# Altium schematic sheet PAGE15.SchDoc
size 386 x 284 mm
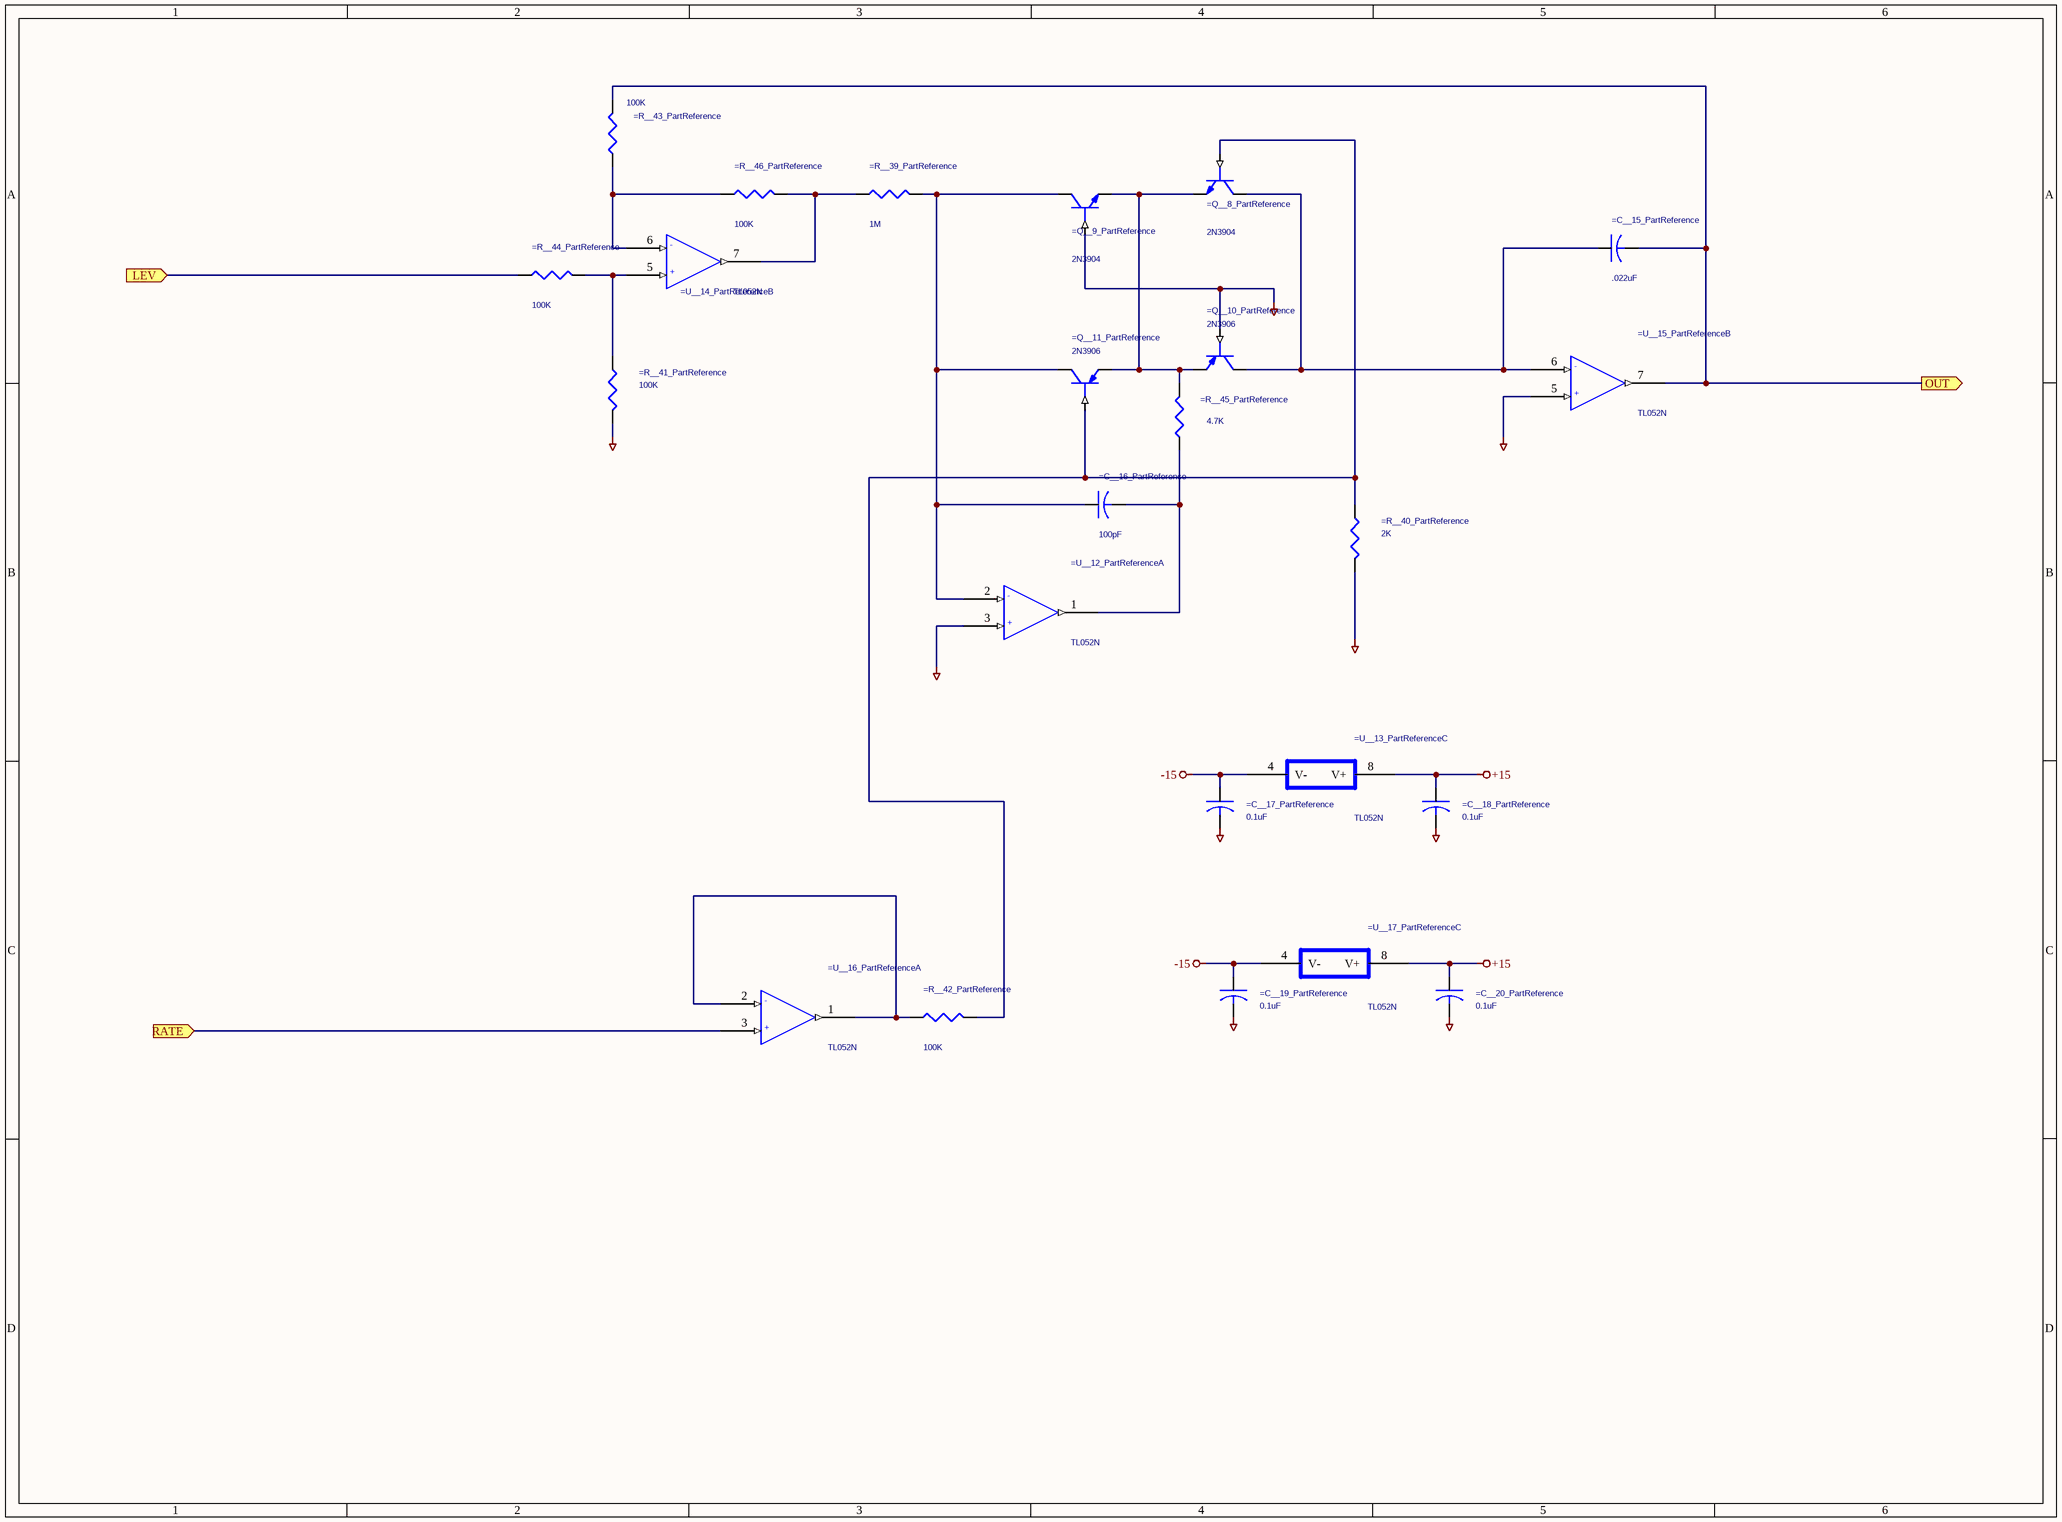
[diagram p0: PAGE15.SchDoc]

## Parts
=C__15_PartReference  .022uF  [CAP-MY0.2X.1]
=C__16_PartReference  100pF  [RAD0.1]
=C__17_PartReference  0.1uF  [AXIALCAP0.3]
=C__18_PartReference  0.1uF  [AXIALCAP0.3]
=C__19_PartReference  0.1uF  [AXIALCAP0.3]
=C__20_PartReference  0.1uF  [AXIALCAP0.3]
=Q__8_PartReference  2N3904  [TO92]
=Q__9_PartReference  2N3904  [TO92]
=Q__10_PartReference  2N3906  [TO92]
=Q__11_PartReference  2N3906  [TO92]
=R__39_PartReference  1M  [AXIAL0.4]
=R__40_PartReference  2K  [AXIAL0.4]
=R__41_PartReference  100K  [AXIAL0.4]
=R__42_PartReference  100K  [AXIAL0.4]
=R__43_PartReference  100K  [AXIAL0.4]
=R__44_PartReference  100K  [AXIAL0.4]
=R__45_PartReference  4.7K  [AXIAL0.4]
=R__46_PartReference  100K  [AXIAL0.4]
=U__12_PartReference  TL052N  [DIP8]  (part A of 3)
=U__13_PartReference  TL052N  [DIP8]  (part C of 3)
=U__14_PartReference  TL052N  [DIP8]  (part B of 3)
=U__15_PartReference  TL052N  [DIP8]  (part B of 3)
=U__16_PartReference  TL052N  [DIP8]  (part A of 3)
=U__17_PartReference  TL052N  [DIP8]  (part C of 3)

## Ports
LEV (in), OUT (out), RATE (in)

## Nets
+15: =C__18_PartReference.1 =C__20_PartReference.1 =U__13_PartReference.8(V+) =U__17_PartReference.8(V+)
-15: =C__17_PartReference.1 =C__19_PartReference.1 =U__13_PartReference.4(V-) =U__17_PartReference.4(V-)
AGND: =C__17_PartReference.2 =C__18_PartReference.2 =C__19_PartReference.2 =C__20_PartReference.2 =Q__9_PartReference.BASE =Q__10_PartReference.BASE =R__40_PartReference.2 =R__41_PartReference.2 =U__12_PartReference.3(+) =U__15_PartReference.5(+)
LEV: =R__44_PartReference.1 ; port LEV
OUT: =C__15_PartReference.2 =R__43_PartReference.2 =U__15_PartReference.7(OUT) ; port OUT
RATE: =U__16_PartReference.3(+) ; port RATE
Net=C__15_PartReference_1: =C__15_PartReference.1 =Q__8_PartReference.COLLECTOR =Q__10_PartReference.COLLECTOR =U__15_PartReference.6(-)
Net=C__16_PartReference_1: =C__16_PartReference.1 =Q__9_PartReference.COLLECTOR =Q__11_PartReference.COLLECTOR =R__39_PartReference.2 =U__12_PartReference.2(-)
Net=C__16_PartReference_2: =C__16_PartReference.2 =R__45_PartReference.1 =U__12_PartReference.1(OUT)
Net=Q__8_PartReference_BASE: =Q__8_PartReference.BASE =Q__11_PartReference.BASE =R__40_PartReference.1 =R__42_PartReference.2
Net=Q__8_PartReference_EMITTER: =Q__8_PartReference.EMITTER =Q__9_PartReference.EMITTER =Q__10_PartReference.EMITTER =Q__11_PartReference.EMITTER =R__45_PartReference.2
Net=R__39_PartReference_1: =R__39_PartReference.1 =R__46_PartReference.2 =U__14_PartReference.7(OUT)
Net=R__41_PartReference_1: =R__41_PartReference.1 =R__44_PartReference.2 =U__14_PartReference.5(+)
Net=R__42_PartReference_1: =R__42_PartReference.1 =U__16_PartReference.1(OUT) =U__16_PartReference.2(-)
Net=R__43_PartReference_1: =R__43_PartReference.1 =R__46_PartReference.1 =U__14_PartReference.6(-)

## Library data of the parts
=C__15_PartReference =C__16_PartReference =C__17_PartReference =C__18_PartReference =C__19_PartReference =C__20_PartReference = CAP_Dup1
  =C__15_PartReference: DIGIKEY PN: P4717-ND
  =C__16_PartReference: MOUSER PN: 140-50P2-101K-RC
=Q__8_PartReference =Q__9_PartReference = NPN: DIGIKEY PN: 2N3904FS-ND
=Q__10_PartReference =Q__11_PartReference = PNP: DIGIKEY PN: 2N3906FS-ND
=R__39_PartReference =R__40_PartReference =R__41_PartReference =R__42_PartReference =R__43_PartReference =R__44_PartReference =R__45_PartReference =R__46_PartReference = R_Dup1
  =R__39_PartReference: MOUSER PN: 271-1M-RC
  =R__40_PartReference: MOUSER PN: 271-2K-RC
  =R__41_PartReference =R__42_PartReference =R__43_PartReference =R__44_PartReference =R__46_PartReference: MOUSER PN: 271-100K-RC
  =R__45_PartReference: MOUSER PN: 271-4.7K-RC
=U__12_PartReference =U__13_PartReference =U__14_PartReference =U__15_PartReference =U__16_PartReference =U__17_PartReference = TL052N: DIGIKEY PN: 296-7163-5-ND
  =U__12_PartReference: PACKAGE: =U__12_PACKAGE
  =U__13_PartReference: PACKAGE: =U__13_PACKAGE
  =U__14_PartReference: PACKAGE: =U__14_PACKAGE
  =U__15_PartReference: PACKAGE: =U__15_PACKAGE
  =U__16_PartReference: PACKAGE: =U__16_PACKAGE
  =U__17_PartReference: PACKAGE: =U__17_PACKAGE